# Altium project Marker_PCB.PrjPcb
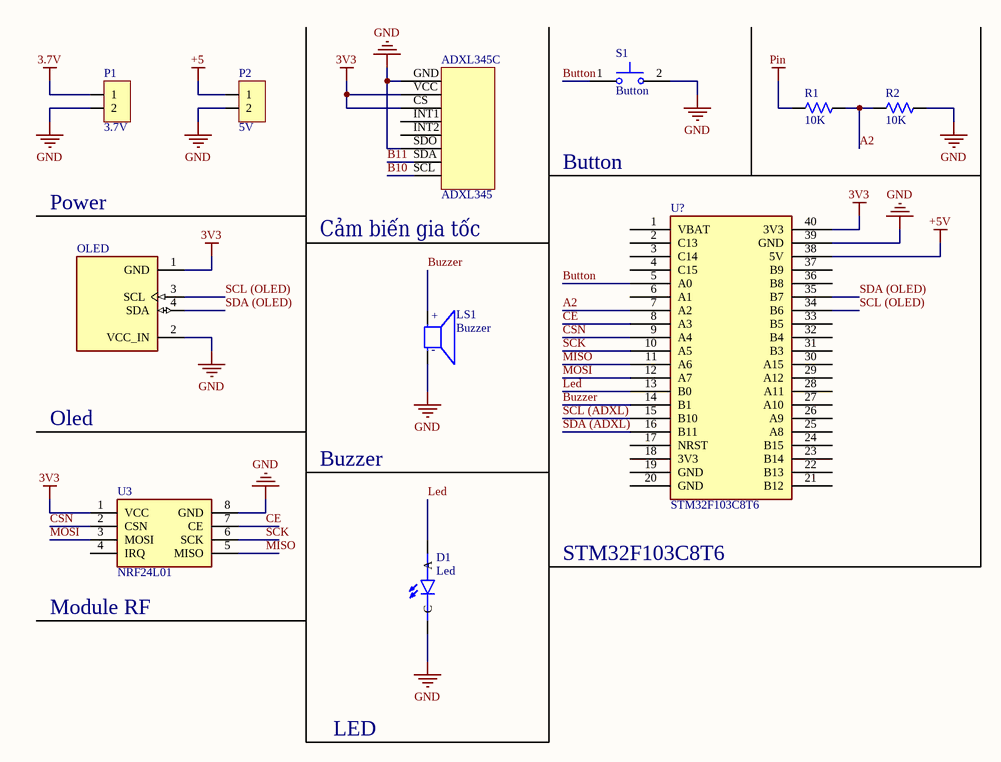
[diagram p0: Marker.SchDoc]
1 sheet, 11 parts. Net scope: global (net labels, ports and power ports of the same name join across sheets).
Board file: Copy of Marker.PcbDoc

## Sheet Marker.SchDoc
size A4; SheetNumber: 1; SheetTotal: 1

### Parts
ADXL345  ADXL345  [GRAVITECH_8FX1-254MM]  (part C of 3)
D1  Led  [LED_WP7113SEC/J3]
LS1  Buzzer  [SPKR_CMI-0955-03TH]
OLED  OLED  [MODULE_DM-OLED096-636]  (value not drawn)
P1  3.7V  [HDR/Header/2]
P2  5V  [HDR/Header/2]
R1  10K  [RESAD730W45L370D210]
R2  10K  [RESAD730W45L370D210]
S1  Button  [SW_BUTT-2]
U3  NRF24L01  [NRF24L01]
U?  STM32F103C8T6  [Stm32 BluePill]

### Nets
3.7V: P1.1
3V3: OLED.1(GND) U3.1(VCC) U?.40(3V3)
+5: P2.1
+5V: U?.38(5V)
GND: D1.C LS1.N OLED.2(VCC_IN) P1.2 P2.2 R2.2 S1.2 U3.8(GND) U?.39(GND)
Pin: R1.1
A2: R1.2 R2.1 U?.7(A2)
Button: S1.1 U?.5(A0)
Buzzer: LS1.P U?.14(B1)
CE: U3.7(CE) U?.8(A3)
CSN: U3.2(CSN) U?.9(A4)
Led: D1.A U?.13(B0)
MISO: U3.5(MISO) U?.11(A6)
MOSI: U3.3(MOSI) U?.12(A7)
SCK: U3.6(SCK) U?.10(A5)
SCL (ADXL): U?.15(B10)
SCL (OLED): OLED.3(SCL) U?.34(B6)
SDA (ADXL): U?.16(B11)
SDA (OLED): OLED.4(SDA) U?.35(B7)

Not connected (* = marked no-connect by the designer): ADXL345 CS GND INT1 INT2 SCL SDA SDO VCC; U3 4(IRQ); U? 1(VBAT) 2(C13) 3(C14) 4(C15) 6(A1) 17(NRST) 18(3V3) 19(GND) 20(GND) 21(B12) 22(B13) 23(B14) 24(B15) 25(A8) 26(A9) 27(A10) 28(A11) 29(A12) 30(A15) 31(B3) 32(B4) 33(B5) 36(B8) 37(B9)

### Notes on the sheet
- Button
- Power
- (near ADXL345) Cảm biến gia tốc
- Oled
- Buzzer
- STM32F103C8T6
- (near U3) Module RF
- LED
- (in symbol CMI-0955-03TH) +; -

### Library data of the parts
ADXL345 = Component_1
D1 = WP7113SEC/J3: Red 625nm LED Indication - Discrete 2.2V Radial; MF: Kingbright; SnapEDA_Link: https://www.snapeda.com/parts/WP7113SEC/J3/Kingbright/view-part/?ref=snap; Package: Radial Kingbright; Value: *; MP: WP7113SEC/J3; Check_prices: https://www.snapeda.com/parts/WP7113SEC/J3/Kingbright/view-part/?ref=eda
LS1 = CMI-0955-03TH: Buzzers Indicator, Internally Driven Magnetic 3 V 30mA 2.7kHz 80dB @ 3V, 10cm Through Hole PC Pins; MF: Same Sky; SnapEDA_Link: https://www.snapeda.com/parts/CMI-0955-03TH/Same+Sky/view-part/?ref=snap; Package: Package; Value: *; MP: CMI-0955-03TH; Check_prices: https://www.snapeda.com/parts/CMI-0955-03TH/Same+Sky/view-part/?ref=eda
OLED = DM-OLED096-636: 0.96â€ 128 X 64 MONOCHROME GRAPHIC OLED DISPLAY MODULE - I2C; SnapEDA_Link: https://www.snapeda.com/parts/DM-OLED096-636/Display+Module/view-part/?ref=snap; Package: Package; Value: *; MF: Display Module; MP: DM-OLED096-636; Check_prices: https://www.snapeda.com/parts/DM-OLED096-636/Display+Module/view-part/?ref=eda
P1 P2 = Header 2: Header, 2-Pin
R1 R2 = MFR-12JT-52-10K: Carbon Film Resistors - Through Hole 1/6W 10K Ohm; MF: Yageo Corporation; SnapEDA_Link: https://www.snapeda.com/parts/MFR-12JT-52-10K/Yageo/view-part/?ref=snap; Package: RADIAL-2 Yageo; Value: *; MP: MFR-12JT-52-10K; Check_prices: https://www.snapeda.com/parts/MFR-12JT-52-10K/Yageo/view-part/?ref=eda
S1 = BUTT-2: Tactile Switches MINI PUSH BUTTON SWITCH 2-PIN QTY. 4; MF: Gravitech; SnapEDA_Link: https://www.snapeda.com/parts/BUTT-2/Gravitech/view-part/?ref=snap; Package: None; Value: *; MP: BUTT-2; Check_prices: https://www.snapeda.com/parts/BUTT-2/Gravitech/view-part/?ref=eda
U3 = NRF24L01: MÓDULO TRANSCEPTOR RF WIRELESS 2.4GHZ
U? = BluePill: Designed By @Alixahedi